# Altium schematic sheet TCAN1146_PINOUT.SchDoc
size A4; SheetNumber: 9; SheetTotal: 10
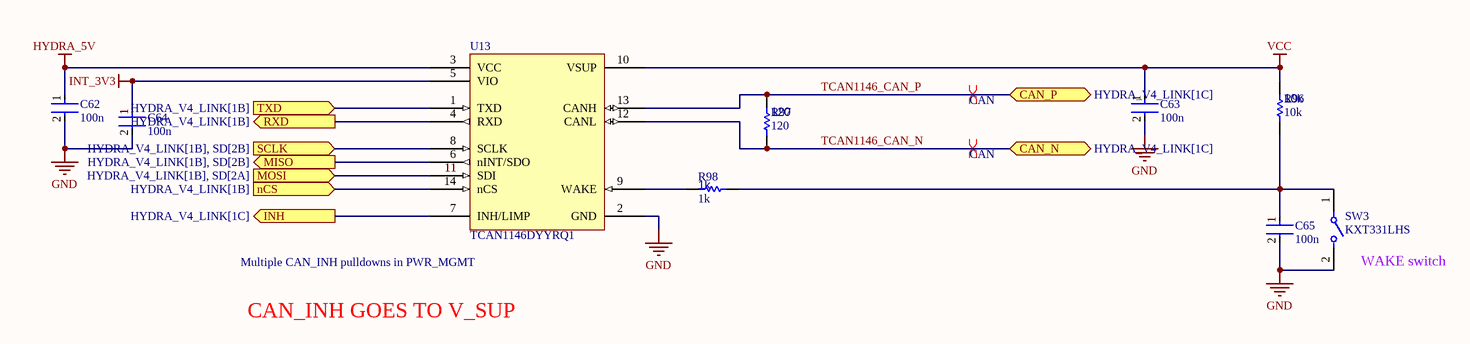
[diagram p0: TCAN1146_PINOUT.SchDoc]

## Parts
C62  100n  [FP-0402-L_1_0_0_05-W_0_5-IPC_A]
C63  100n  [FP-0402-L_1_0_0_05-W_0_5-IPC_A]
C64  100n  [FP-0402-L_1_0_0_05-W_0_5-IPC_A]
C65  100n  [FP-0402-L_1_0_0_05-W_0_5-IPC_A]
R96  10k  [R0603B]
R97  120  [R0603B]
R98  1k  [R0603B]
SW3  KXT331LHS  [FP-KXT331LHS-MFG]
U13  TCAN1146DYYRQ1  [TCAN1146DYYRQ1-Footprint-1]

## Ports
CAN_N (bidir, see HYDRA_V4_LINK[1C]), CAN_P (bidir, see HYDRA_V4_LINK[1C]), INH (out, see HYDRA_V4_LINK[1C]), MISO (out, see HYDRA_V4_LINK[1B], SD[2B]), MOSI (in, see HYDRA_V4_LINK[1B], SD[2A]), nCS (in, see HYDRA_V4_LINK[1B]), RXD (out, see HYDRA_V4_LINK[1B]), SCLK (in, see HYDRA_V4_LINK[1B], SD[2B]), TXD (in, see HYDRA_V4_LINK[1B])

## Nets
GND: C62.2 C63.2 C64.2 C65.2 SW3.2 U13.2(GND)
HYDRA_5V: C62.1 U13.3(VCC)
INT_3V3: C64.1 U13.5(VIO)
VCC: C63.1 R96.2 U13.10(VSUP)
INH: U13.7(INH/LIMP) ; port INH
MISO: U13.6(nINT/SDO) ; port MISO
MOSI: U13.11(SDI) ; port MOSI
nCS: U13.14(nCS) ; port nCS
RXD: U13.4(RXD) ; port RXD
SCLK: U13.8(SCLK) ; port SCLK
TCAN1146_CAN_N: R97.1 U13.12(CANL) ; port CAN_N
TCAN1146_CAN_P: R97.2 U13.13(CANH) ; port CAN_P
TXD: U13.1(TXD) ; port TXD
NetC65_1: C65.1 R96.1 R98.1 SW3.1
NetR98_2: R98.2 U13.9(WAKE)

## Layout directives
differential pair; net class CAN: TCAN1146_CAN_N, TCAN1146_CAN_P

## Notes on the sheet
- (near U13) Multiple CAN_INH pulldowns in PWR_MGMT
- (near SW3) WAKE switch
- CAN_INH GOES TO V_SUP

## Library data of the parts
C62-C65 = CMP-001-00058-1: LARGE PADS, 0402 CAP, CHANGE COMMENT TO MATCH REAL P/N; Capacitor Type: Ceramic; Value: 100n; Min Operating Temperature: -55°C; Mounting Technology: Surface Mount; Pins: 2; Case/Package: 0402; RoHS Compliant: Yes; Max Operating Temperature: 85°C
R96-R98 = CMP-009-00002-14: Resistor
  R96: Value: 10k
  R97: Value: 120
  R98: Value: 1k
SW3 = CMP-10040-000029-1: SWITCH TACTILE SPST-NO 0.02A 15V; Operating Force: 240gf; Switch Travel: 0.13mm; Illumination Type: Non-Illuminated; Throw Configuration: SPST; Number of Ports: 1; Current Rating: 5A; Mechanical Life: 500000Cycles; Switch Function: Off-Mom; Connector Type: USB; Actuator Type: Standard; Gender: Receptacle; Number of Contacts: 24; Contact Plating: Gold; Insulation Color: Black; Min Operating Temperature: -40°C; Packaging: Tape and Reel; Flammability Rating: UL94 V-0; Max Operating Temperature: 85°C; Termination: Solder; Mount: Surface Mount
U13 = CMP-318-000000-2: Automotive CAN FD transceiver with watchdog, bus diagnostics and partial networking via sele 14-SOT-23-THIN -40 to 150; Component Type: Standard; Design Item ID: CMP-015-00012-2; Pin Count: 14; Source: TCAN1146DYYRQ1.SchLib